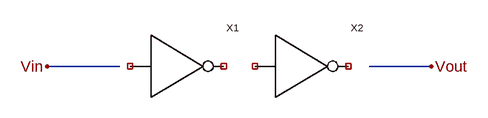
[diagram p0: schematic buffer.asc]
buffer.asc, the LTspice schematic file:
Version 4
SHEET 1 880 680
WIRE 32 192 -80 192
WIRE 512 192 416 192
FLAG -80 192 Vin
FLAG 512 192 Vout
SYMBOL inverter 80 192 R0
SYMATTR InstName X1
SYMBOL inverter 272 192 R0
SYMATTR InstName X2

The netlist it stands for:
* buffer.asc
XX1 NC_01 NC_02 inverter  ; pins Vin Vout
XX2 NC_03 NC_04 inverter  ; pins Vin Vout
.backanno
.end